# EAGLE design customLidar (EAGLE 9.3.0)
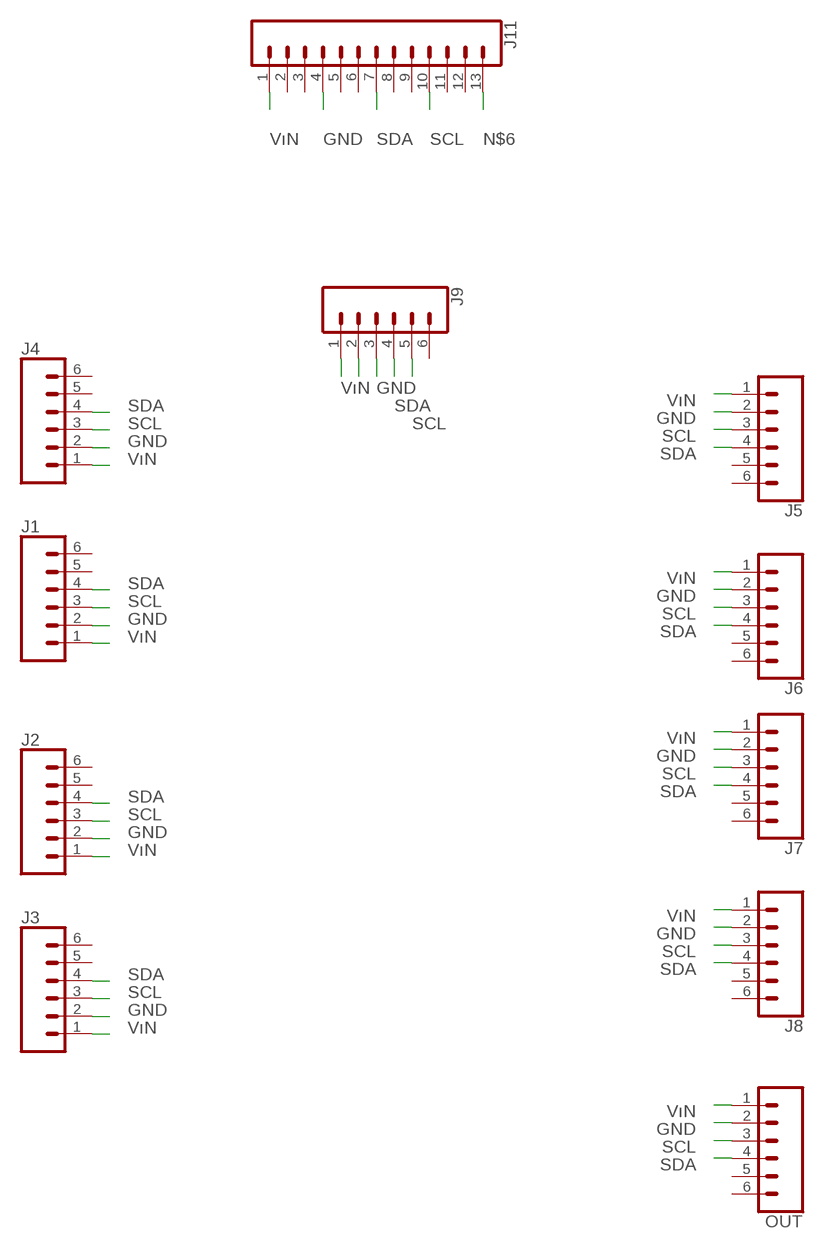
[diagram p0: schematic, sheet 1]

## Parts
J1  CONN_06LONGPADS  [1X06_LONGPADS]
J2  CONN_06LONGPADS  [1X06_LONGPADS]
J3  CONN_06LONGPADS  [1X06_LONGPADS]
J4  CONN_06LONGPADS  [1X06_LONGPADS]
J5  CONN_06LONGPADS  [1X06_LONGPADS]
J6  CONN_06LONGPADS  [1X06_LONGPADS]
J7  CONN_06LONGPADS  [1X06_LONGPADS]
J8  CONN_06LONGPADS  [1X06_LONGPADS]
J9  CONN_06LONGPADS  [1X06_LONGPADS]
J11  CONN_13LONGPADS  [1X13-LONGPADS]
OUT  CONN_06LONGPADS  [1X06_LONGPADS]

## Nets
GND: J1.2 J2.2 J3.2 J4.2 J5.2 J6.2 J7.2 J8.2 J9.3 J11.4 OUT.2
N$2: J9.2
N$6: J11.13
SCL: J1.3 J2.3 J3.3 J4.3 J5.3 J6.3 J7.3 J8.3 J9.5 J11.10 OUT.3
SDA: J1.4 J2.4 J3.4 J4.4 J5.4 J6.4 J7.4 J8.4 J9.4 J11.7 OUT.4
VıN: J1.1 J2.1 J3.1 J4.1 J5.1 J6.1 J7.1 J8.1 J9.1 J11.1 OUT.1
Unconnected: J1.5 J1.6 J2.5 J2.6 J3.5 J3.6 J4.5 J4.6 J5.5 J5.6 J6.5 J6.6 J7.5 J7.6 J8.5 J8.6 J9.6 J11.2 J11.3 J11.5 J11.6 J11.8 J11.9 J11.11 J11.12 OUT.5 OUT.6

## Library data of the parts
J1-J9 OUT = SparkFun-Connectors:CONN_06: Multi connection point. Often used as Generic Header-pin footprint for 0.1 inch spaced/style header connections On any of the 0.1 inch spaced packages, you can populate with these: Break Away Headers - Straight <https://www.sparkfun.com/products/116> (PRT-00116) Break Away Male Headers - Right Angle <https://www.sparkfun.com/products/553> (PRT-00553) Female Headers <https://www.sparkfun.com/products/115> (PRT-00115) Break Away Headers - Machine Pin <https://www.sparkfun.com/products/117> (PRT-00117) Break Away Female Headers - Swiss Machine Pin <https://www.sparkfun.com/products/743> (PRT-00743) Arduino Stackable Header - 6 Pin <https://www.sparkfun.com/products/9280> (PRT-09280) For SCREWTERMINALS and SPRING TERMINALS visit here: Screw Terimnals on SparkFun.com <https://www.sparkfun.com/search/results?term=Screw+Terminals> (5mm/3.5mm/2.54mm spacing) This device is also useful as a general connection point to wire up your design to another part of your project. Our various solder wires solder well into these plated through hole pads. Hook-Up Wire - Assortment (Stranded, 22 AWG) <https://www.sparkfun.com/products/11375> (PRT-11375) Hook-Up Wire - Assortment (Solid Core, 22 AWG) <https://www.sparkfun.com/products/11367> (PRT-11367) View the entire wire category on our website here <https://www.sparkfun.com/categories/141>
J11 = SparkFun-Connectors:CONN_13: Multi connection point. Often used as Generic Header-pin footprint for 0.1 inch spaced/style header connections On any of the 0.1 inch spaced packages, you can populate with these: Break Away Headers - Straight <https://www.sparkfun.com/products/116> (PRT-00116) Break Away Male Headers - Right Angle <https://www.sparkfun.com/products/553> (PRT-00553) Female Headers <https://www.sparkfun.com/products/115> (PRT-00115) Break Away Headers - Machine Pin <https://www.sparkfun.com/products/117> (PRT-00117) Break Away Female Headers - Swiss Machine Pin <https://www.sparkfun.com/products/743> (PRT-00743) For SCREWTERMINALS and SPRING TERMINALS visit here: Screw Terimnals on SparkFun.com <https://www.sparkfun.com/search/results?term=Screw+Terminals> (5mm/3.5mm/2.54mm spacing) This device is also useful as a general connection point to wire up your design to another part of your project. Our various solder wires solder well into these plated through hole pads. Hook-Up Wire - Assortment (Stranded, 22 AWG) <https://www.sparkfun.com/products/11375> (PRT-11375) Hook-Up Wire - Assortment (Solid Core, 22 AWG) <https://www.sparkfun.com/products/11367> (PRT-11367) View the entire wire category on our website here <https://www.sparkfun.com/categories/141> Special notes: Molex polarized connector foot print use with SKU : PRT-08231 with associated crimp pins and housings. 1MM SMD Version SKU: PRT-10208 NOTES ON THE VARIANTS LOCK and LOCK_LONGPADS... This footprint was designed to help hold the alignment of a through-hole component (i.e. 6-pin header) while soldering it into place. You may notice that each hole has been shifted either up or down by 0.005 of an inch from it's more standard position (which is a perfectly straight line). This slight alteration caused the pins (the squares in the middle) to touch the edges of the holes. Because they are alternating, it causes a "brace" to hold the component in place. 0.005 has proven to be the perfect amount of "off-center" position when using our standard breakaway headers. Although looks a little odd when you look at the bare footprint, once you have a header in there, the alteration is very hard to notice. Also,if you push a header all the way into place, it is covered up entirely on the bottom side.

## Board
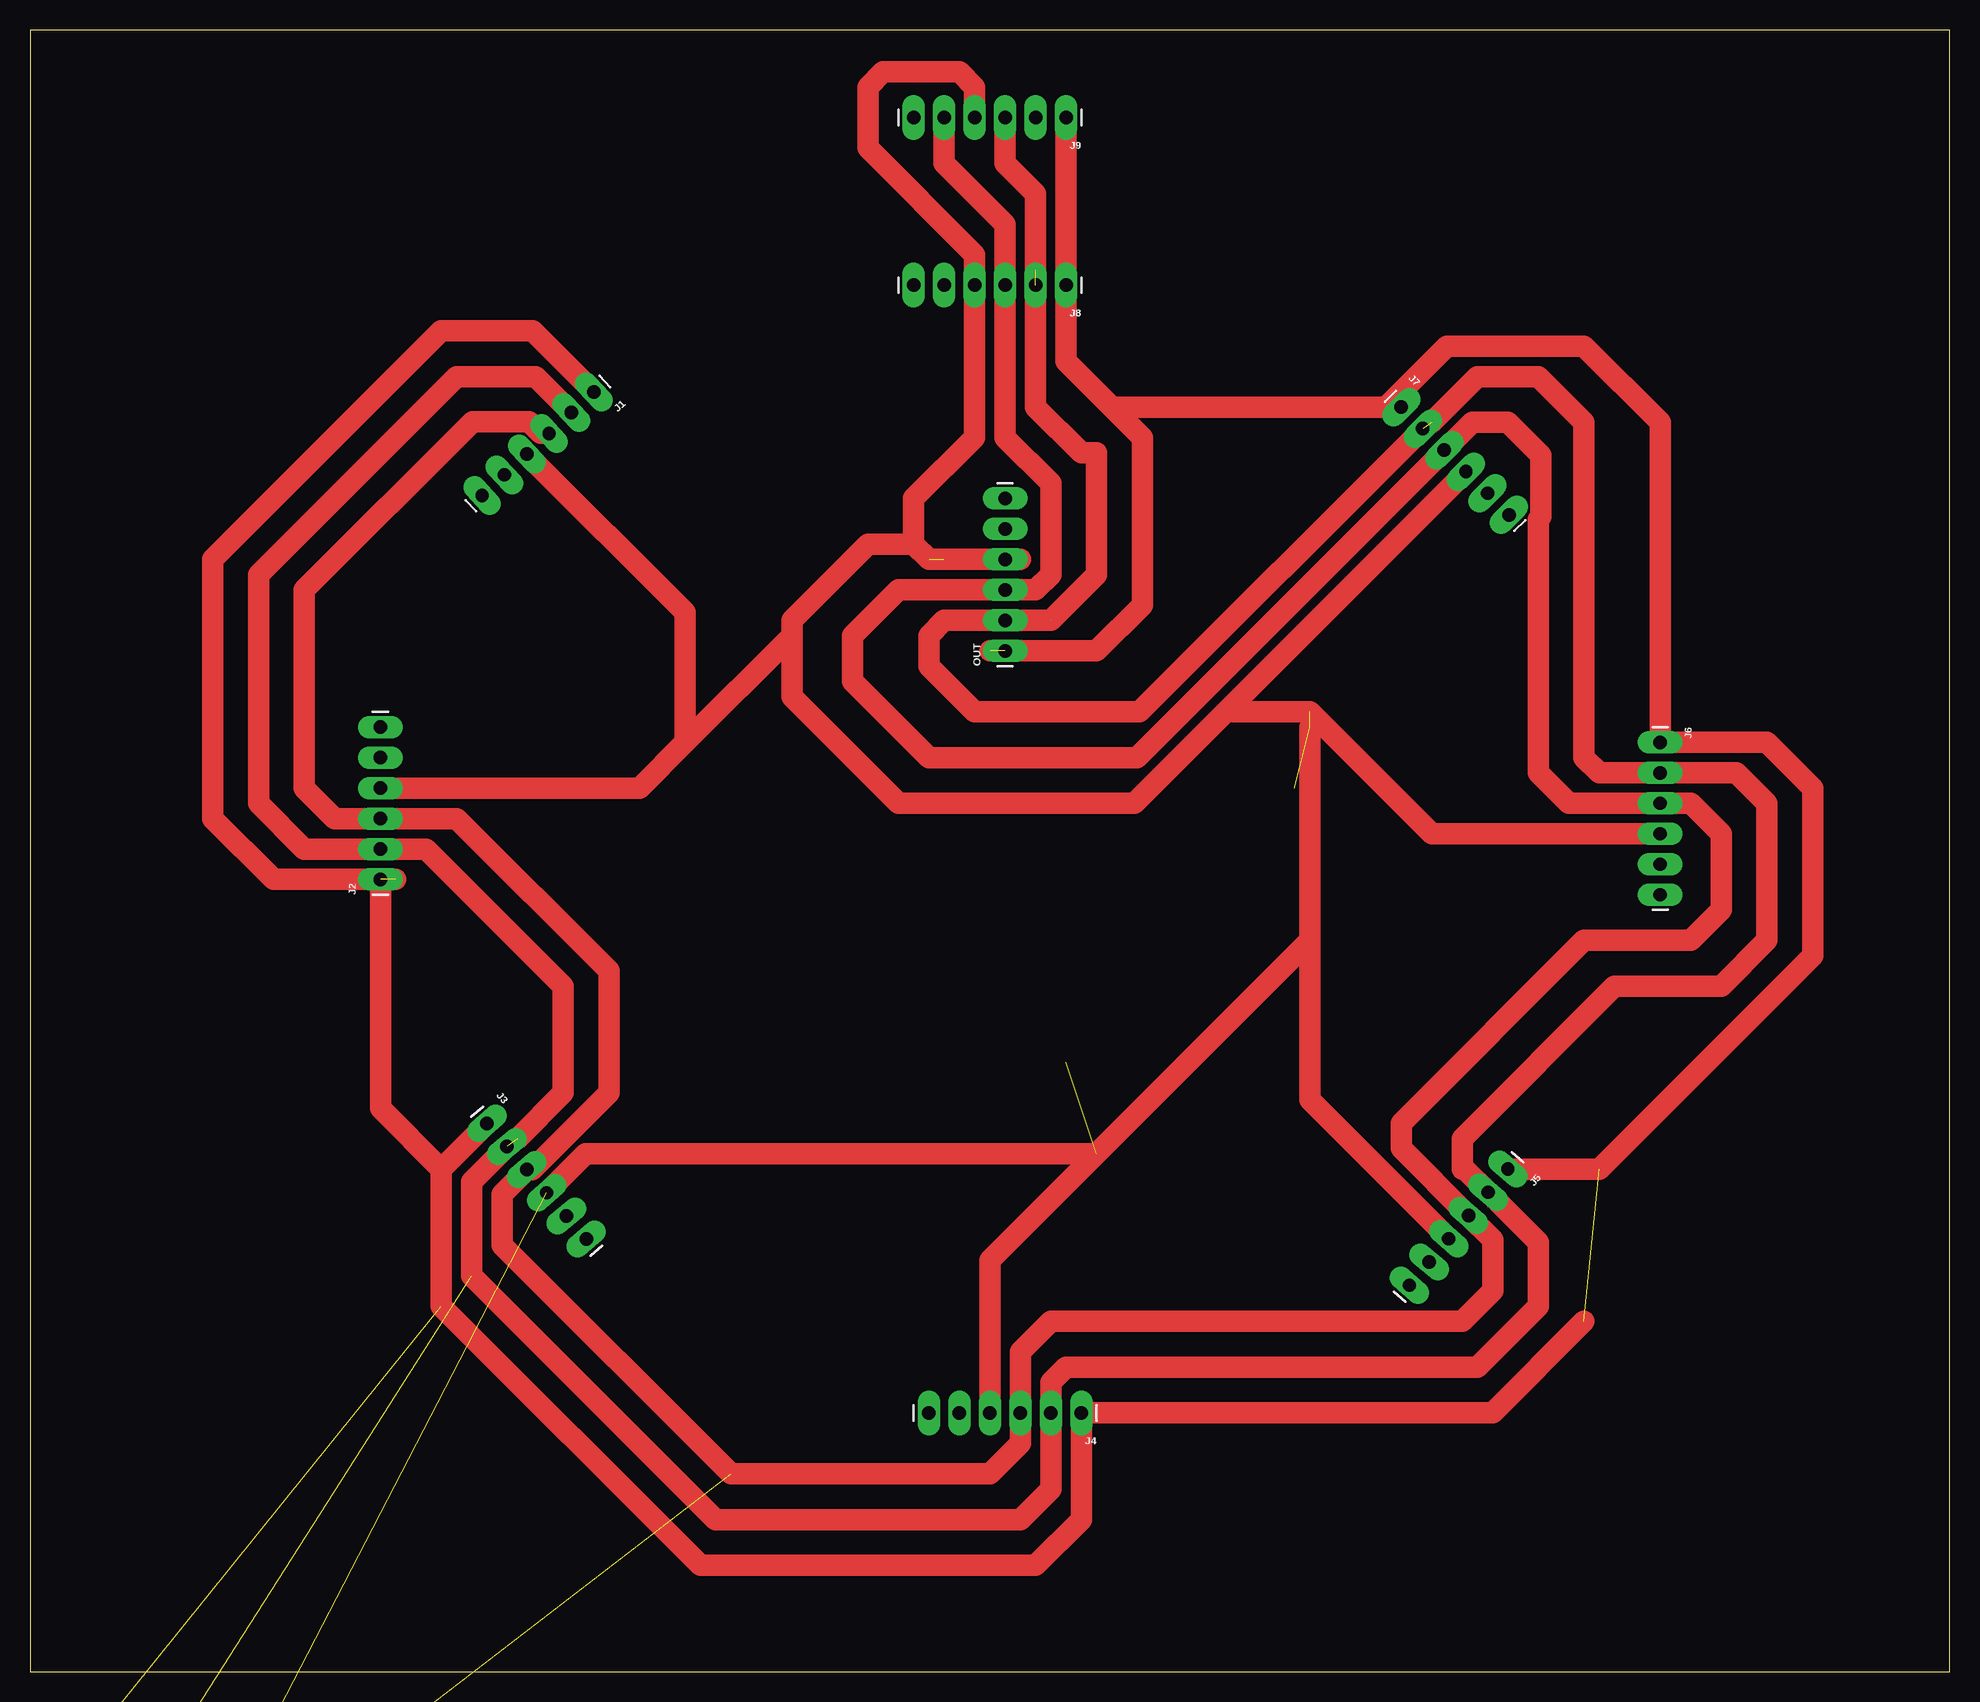
[diagram p1: board, top side]
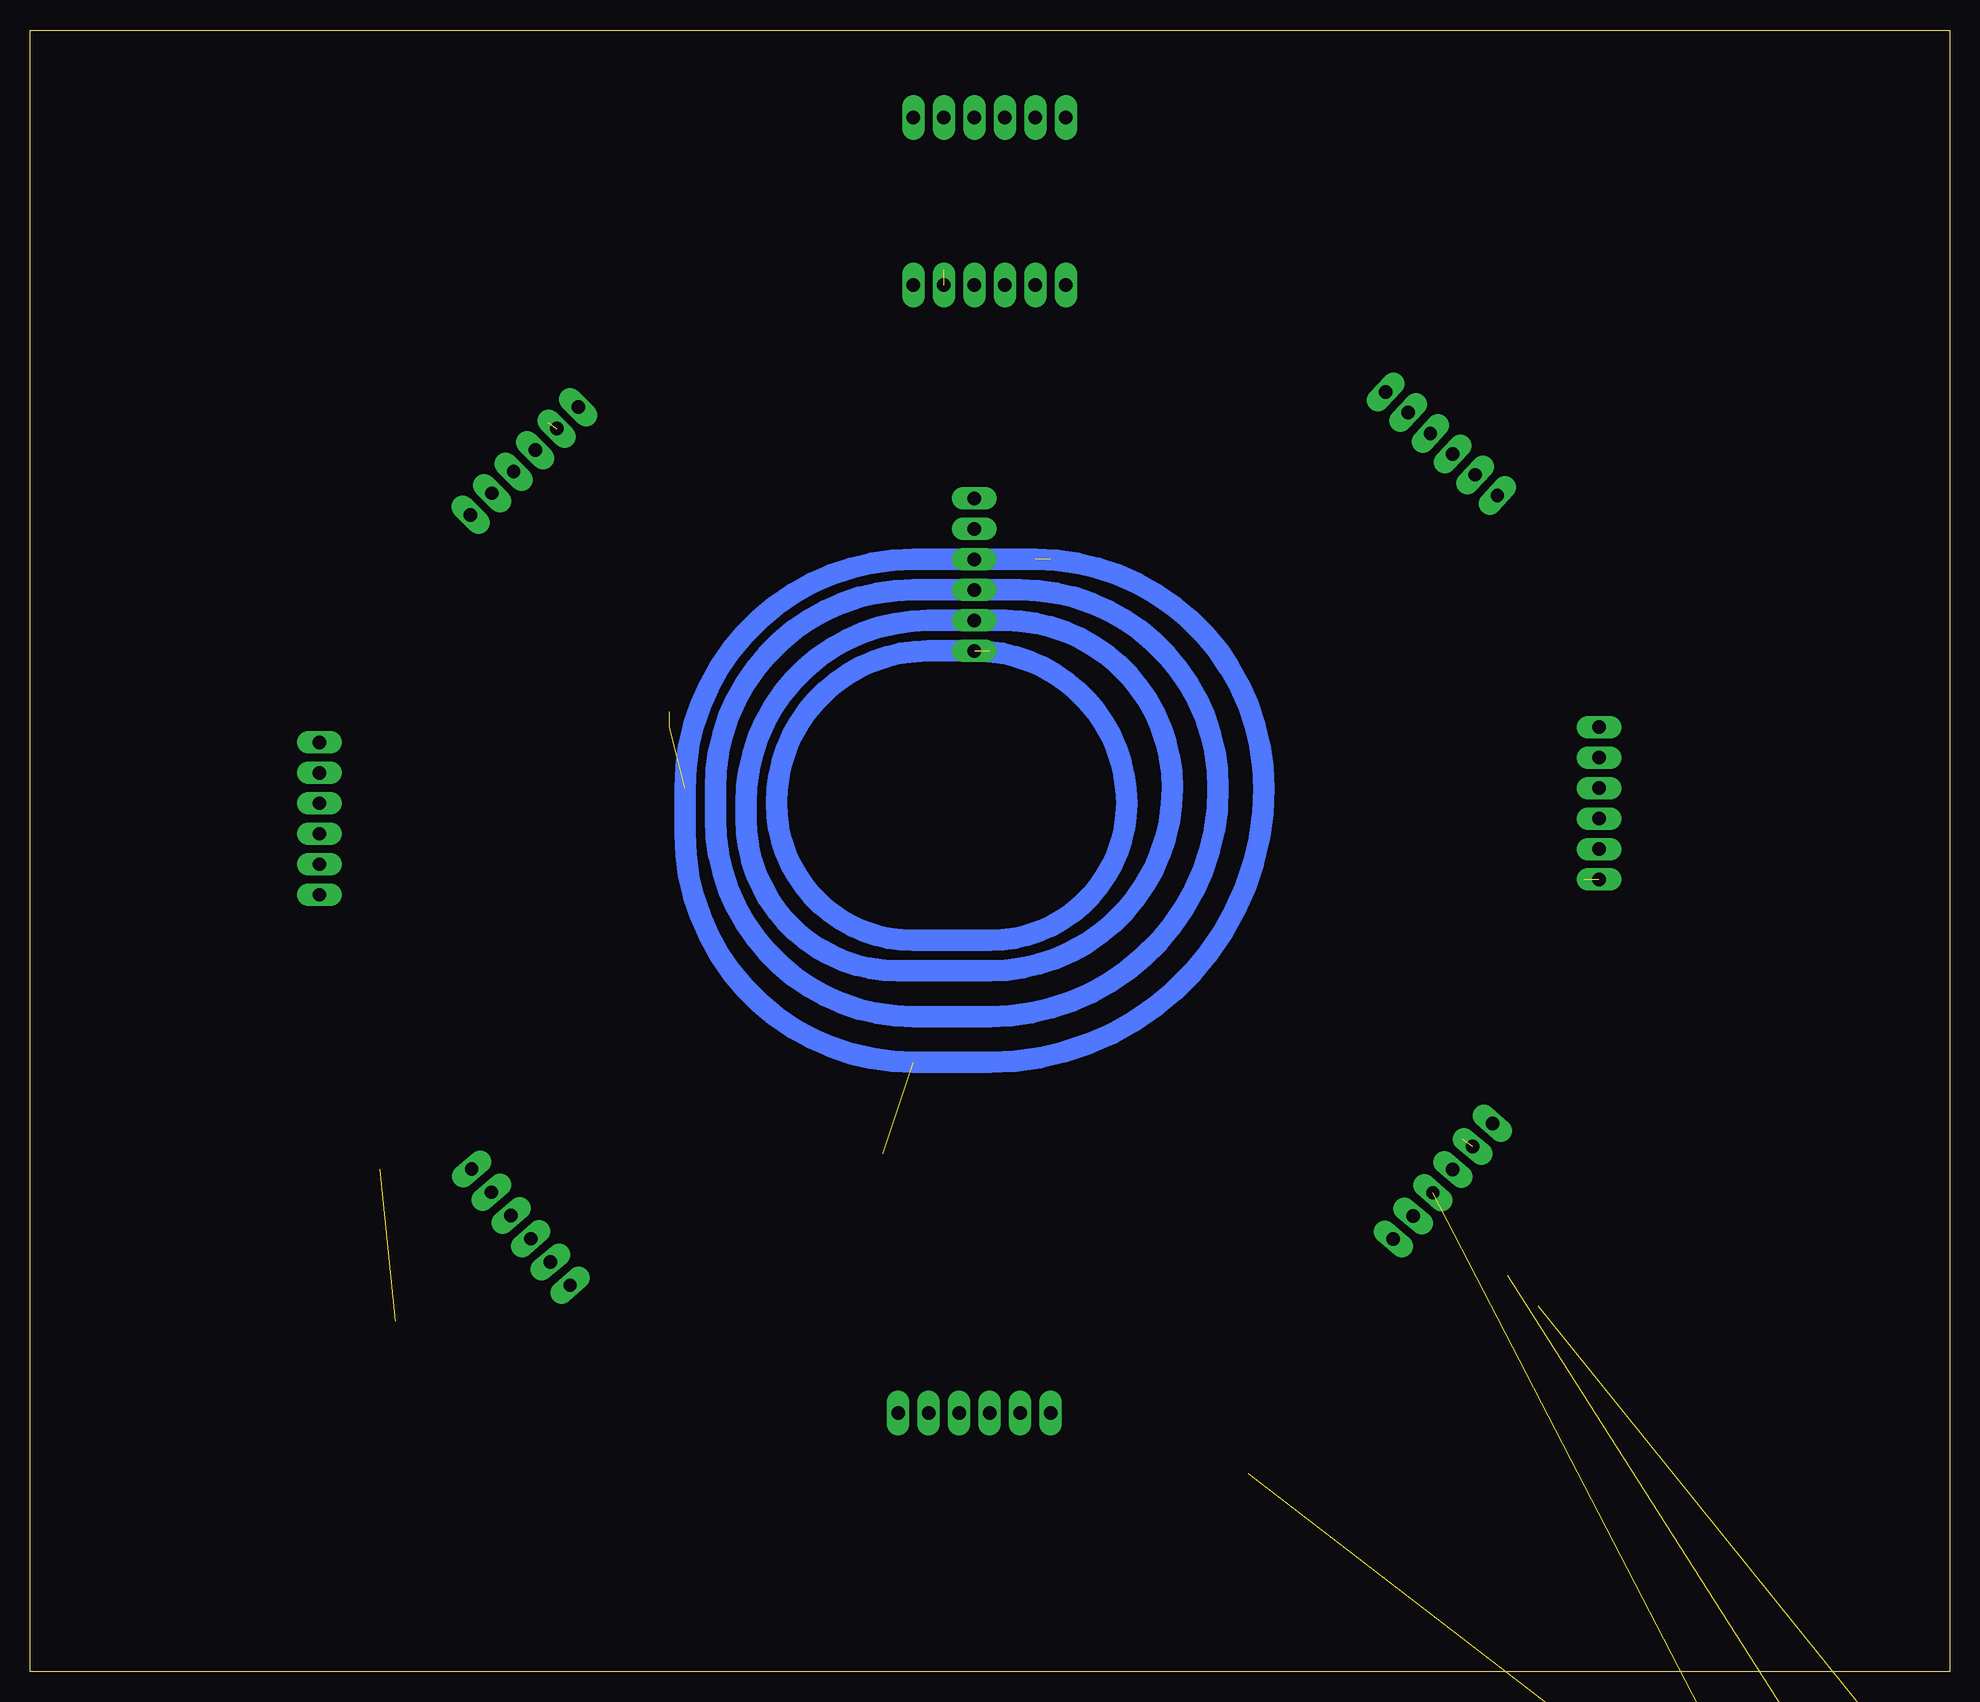
[diagram p2: board, bottom side, seen from below]

Size 160 x 136.83 mm. Coordinates in mm from the lower left corner, seen from the top.
Outline: 0,0 160,0 160,136.83 0,136.83 0,0
Copper layers (1*16): Top 0.035mm / dielectric 1.5mm / Bottom 0.035mm
Design rules "default": minimum track width 6mil, minimum drill 0.35mm, track to track 6mil, track to pad 6mil, pad to pad 6mil, via to via 6mil, smd to smd 6mil, copper to edge 40mil, drill to drill 6mil, minimum pad ring 10mil, minimum via ring 8mil, stop-mask expansion 4mil, vias tented up to drill 0mil, thermal gap 10mil

### Footprints (pad centres in the part's own frame; a part is rotated, then mirrored left to right if it is on the bottom)
1X06_LONGPADS = drill 1.118 pad 1.88 long: 1 0,0; 2 2.54,0; 3 5.08,0; 4 7.62,0; 5 10.16,0; 6 12.7,0
1X13-LONGPADS = drill 1.118 long: 1 0,0; 2 2.54,0; 3 5.08,0; 4 7.62,0; 5 10.16,0; 6 12.7,0; 7 15.24,0; 8 17.78,0; 9 20.32,0; 10 22.86,0; 11 25.4,0; 12 27.94,0; 13 30.48,0

### Placement (x,y rotation side)
J1  46.99,106.68 222.9 top
J2  29.21,66.04 90 top
J3  38.1,45.72 310.6 top
J4  87.63,21.59 180 top
J5  123.19,41.91 229.7 top
J6  135.89,77.47 270 top
J7  114.3,105.41 315 top
J8  86.36,115.57 180 top
J9  86.36,129.54 180 top
J11  2.54,-8.89 0 top  (outside the outline)
OUT  81.28,85.09 90 top

### Tracks (layer width: path | path; a pad name or v marks a point on that pad's centre or on a via)
GND  (5 unrouted)
  Top 1.778: J8.2 83.82,105.41 87.63,101.6 88.9,101.6 88.9,91.44 85.09,87.63 76.2,87.63 74.93,86.36 74.93,83.82 78.74,80.01 92.49,80.01 J7.2 | 116.84,104.14 120.65,107.95 125.73,107.95 129.54,104.14 129.54,76.2 130.81,74.93 J6.2 142.24,74.93 144.78,72.39 144.78,60.96 140.97,57.15 132.08,57.15 119.38,44.45 119.38,41.91 119.61,41.91 J5.2 125.73,35.79 125.73,30.48 120.65,25.4 86.36,25.4 85.09,24.13 J4.2 85.09,15.24 82.55,12.7 57.15,12.7 36.83,33.02 36.83,40.87 J3.2 | 40.64,44.45 44.45,48.26 44.45,57.15 33.02,68.58 J2.2 22.86,68.58 19.05,72.39 19.05,91.44 35.56,107.95 42.13,107.95 J1.2 | J9.3 81.28,125.73 83.82,123.19 83.82,116.84
  Bottom 1.778: OUT.2 85.09,87.63 arc-90 100.33,72.39 100.33,71.12 arc-90 87.63,58.42 80.01,58.42 arc-90 64.77,73.66 arc-90 78.74,87.63 OUT.2
SCL  (1 unrouted)
  Top 1.778: OUT.3 83.82,90.17 85.09,91.44 85.09,99.06 81.28,102.87 J8.3 81.28,120.65 76.2,125.73 J9.5 | OUT.3 80.01,90.17 | OUT.3 72.39,90.17 68.58,86.36 68.58,82.55 74.93,76.2 92.27,76.2 J7.3 120.21,104.14 123.19,104.14 125.93,101.4 125.93,96.27 125.73,96.08 125.73,74.93 128.27,72.39 J6.3 138.43,72.39 140.97,69.85 140.97,63.5 138.43,60.96 129.54,60.96 114.3,45.72 114.3,43.64 J5.3 121.92,36.02 121.92,31.75 119.38,29.21 85.09,29.21 82.55,26.67 J4.3 82.55,19.05 80.01,16.51 58.42,16.51 39.37,35.56 39.37,39.83 J3.3 41.86,41.86 48.26,48.26 48.26,58.42 35.56,71.12 J2.3 25.4,71.12 22.86,73.66 22.86,90.17 36.88,104.19 41.6,104.19 42.57,103.22 J1.3
  Bottom 1.778: OUT.3 86.36,90.17 arc-90 102.87,73.66 102.87,71.12 arc-90 86.36,54.61 80.01,54.61 arc-90 60.96,73.66 arc-90 77.47,90.17 OUT.3
SDA  (5 unrouted)
  Top 1.778: 73.66,93.98 73.66,97.79 78.74,102.87 J8.4 78.74,118.11 69.85,127 69.85,132.08 71.12,133.35 77.47,133.35 78.74,132.08 J9.4 | 73.66,93.98 74.93,92.71 82.55,92.71 | J7.4 92.06,72.39 72.39,72.39 63.5,81.28 63.5,86.36 | 63.5,86.36 63.5,87.63 69.85,93.98 73.66,93.98 | J6.4 116.84,69.85 106.68,80.01 100.33,80.01 | J5.4 106.68,47.68 106.68,78.74 | 106.68,57.15 106.68,60.96 88.9,43.18 | J4.4 80.01,34.29 88.9,43.18 | J3.4 46.3,43.18 88.9,43.18 | 54.61,77.47 50.8,73.66 J2.4 | 54.61,77.47 63.5,86.36 | J1.4 54.61,88.29 54.61,77.47
  Bottom 1.778: OUT.4 86.36,92.71 arc-90 105.41,73.66 105.41,69.85 arc-90 86.36,50.8 80.01,50.8 arc-90 57.15,73.66 arc-90 76.2,92.71 OUT.4
VıN  (4 unrouted)
  Top 1.778: 80.01,85.09 88.9,85.09 92.71,88.9 92.71,102.87 90.17,105.41 | 90.17,105.41 86.36,109.22 J8.1 J9.1 | J7.1 113.03,105.41 | 113.03,105.41 90.17,105.41 | 113.03,105.41 118.11,110.49 129.54,110.49 135.89,104.14 J6.1 144.78,77.47 148.59,73.66 148.59,59.69 130.81,41.91 J5.1 | 129.54,29.21 121.92,21.59 J4.1 87.63,12.7 83.82,8.89 55.88,8.89 34.29,30.48 34.29,41.91 | J3.1 34.29,41.91 | 34.29,41.91 29.21,46.99 J2.1 | J1.1 41.91,111.76 34.29,111.76 15.24,92.71 15.24,71.12 20.32,66.04 30.48,66.04
  Bottom 1.778: OUT.1 85.09,85.09 arc-90 97.79,72.39 arc-90 86.36,60.96 80.01,60.96 arc-90 68.58,72.39 arc-90 OUT.1